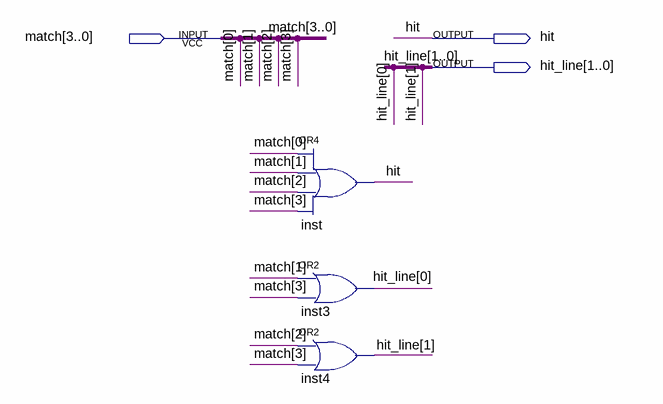
[diagram p0: schematic sheet]
// Quartus schematic hit_encoder_4.bdf as structural Verilog: 3 symbols, 3 pins
module hit_encoder_4 (
  input  [3:0] match,
  output hit,
  output [1:0] hit_line
);

  or inst (hit, match[0], match[1], match[2], match[3]);
  or inst3 (hit_line[0], match[1], match[3]);
  or inst4 (hit_line[1], match[2], match[3]);
endmodule
